# EAGLE design scheme (EAGLE 9.1.0)
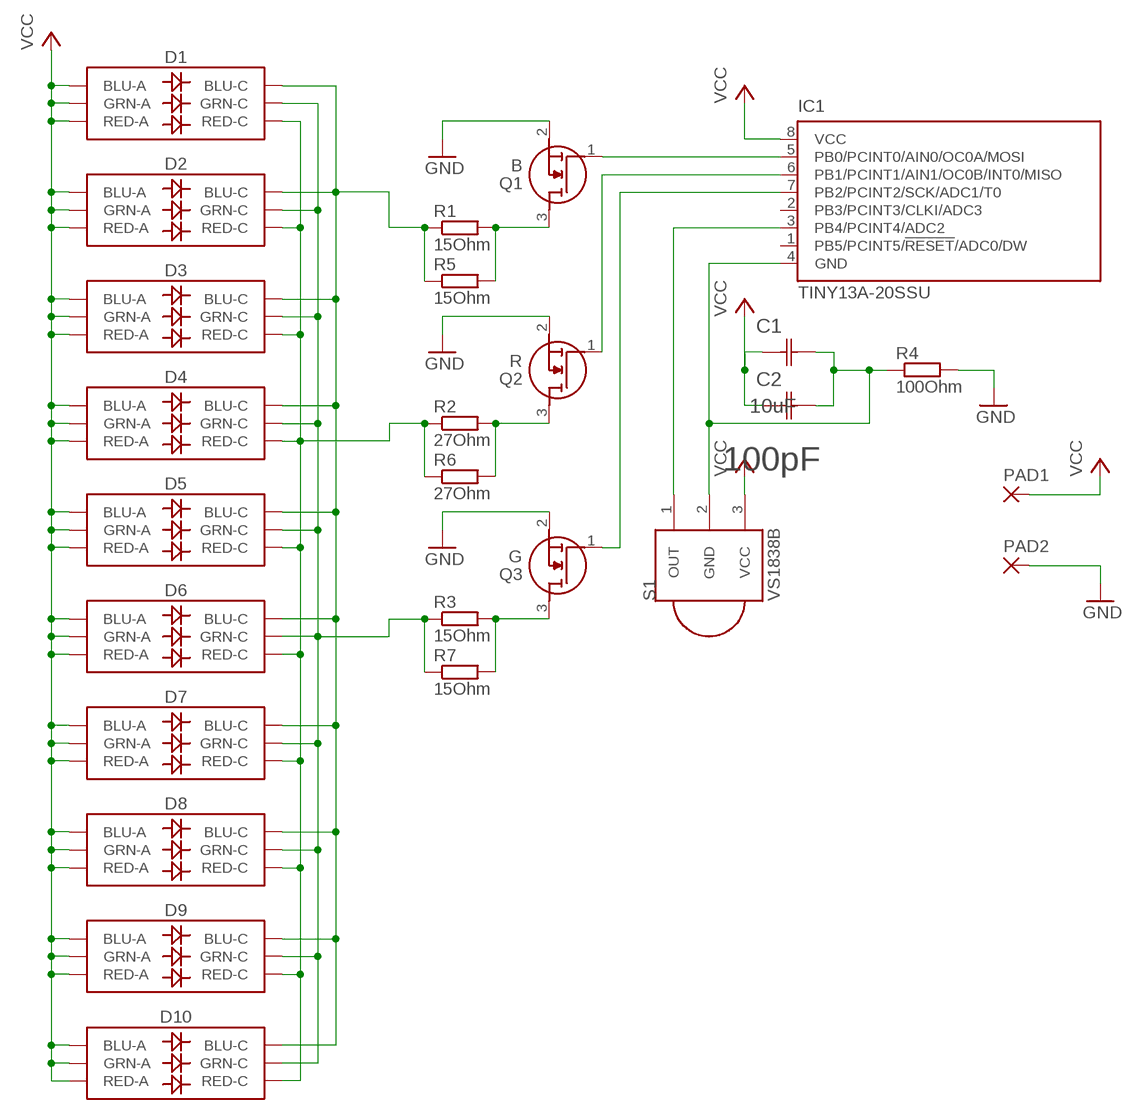
[diagram p0: schematic, sheet 1]

## Parts
C1  10uF  12061A101JAT2A  [CAPC3216X94N]
C2  100pF  08051A100JAT2A  [CAPC2013X94N]
D1  LED-RGBNO_IC  [LED-TRICOLOR-5050]
D2  LED-RGBNO_IC  [LED-TRICOLOR-5050]
D3  LED-RGBNO_IC  [LED-TRICOLOR-5050]
D4  LED-RGBNO_IC  [LED-TRICOLOR-5050]
D5  LED-RGBNO_IC  [LED-TRICOLOR-5050]
D6  LED-RGBNO_IC  [LED-TRICOLOR-5050]
D7  LED-RGBNO_IC  [LED-TRICOLOR-5050]
D8  LED-RGBNO_IC  [LED-TRICOLOR-5050]
D9  LED-RGBNO_IC  [LED-TRICOLOR-5050]
D10  LED-RGBNO_IC  [LED-TRICOLOR-5050]
IC1  TINY13A-20SSU  TINY13-20SSU  [8S1]
PAD1  SMD2  [SMD1,27-2,54]
PAD2  SMD2  [SMD1,27-2,54]
Q1  B  AO3400  [SOT95P280X125-3N]
Q2  R  AO3400  [SOT95P280X125-3N]
Q3  G  AO3400  [SOT95P280X125-3N]
R1  15Ohm  R-EU_R1206  [R1206]
R2  27Ohm  R-EU_R1206  [R1206]
R3  15Ohm  R-EU_R1206  [R1206]
R4  100Ohm  R-EU_R0805  [R0805]
R5  15Ohm  R-EU_R0805  [R0805]
R6  27Ohm  R-EU_R0805  [R0805]
R7  15Ohm  R-EU_R0805  [R0805]
S1  VS1838B  PNA460XM  [PNA460XM]

## Nets
GND: PAD2.1(P) Q1.2(S) Q2.2(S) Q3.2(S) R4.2
N$1: IC1.3(PB4/PCINT4/ADC2) S1.1(OUT)
N$2: IC1.5(PB0/PCINT0/AIN0/OC0A/MOSI) Q1.1(G)
N$3: IC1.6(PB1/PCINT1/AIN1/OC0B/INT0/MISO) Q2.1(G)
N$4: IC1.7(PB2/PCINT2/SCK/ADC1/T0) Q3.1(G)
N$6: D1.4(GRN-C) D2.4(GRN-C) D3.4(GRN-C) D4.4(GRN-C) D5.4(GRN-C) D6.4(GRN-C) D7.4(GRN-C) D8.4(GRN-C) D9.4(GRN-C) D10.4(GRN-C) R3.1 R7.1
N$7: D1.6(BLU-C) D2.6(BLU-C) D3.6(BLU-C) D4.6(BLU-C) D5.6(BLU-C) D6.6(BLU-C) D7.6(BLU-C) D8.6(BLU-C) D9.6(BLU-C) D10.6(BLU-C) R1.1 R5.1
N$8: Q1.3(D) R1.2 R5.2
N$9: Q2.3(D) R2.2 R6.2
N$10: Q3.3(D) R3.2 R7.2
N$12: C1.2(C2) C2.2(C2) IC1.4(GND) R4.1 S1.2(GND)
N$13: D1.5(RED-C) D2.5(RED-C) D3.5(RED-C) D4.5(RED-C) D5.5(RED-C) D6.5(RED-C) D7.5(RED-C) D8.5(RED-C) D9.5(RED-C) D10.5(RED-C) R2.1 R6.1
VCC: C1.1(C1) C2.1(C1) D1.1(BLU-A) D1.2(RED-A) D1.3(GRN-A) D2.1(BLU-A) D2.2(RED-A) D2.3(GRN-A) D3.1(BLU-A) D3.2(RED-A) D3.3(GRN-A) D4.1(BLU-A) D4.2(RED-A) D4.3(GRN-A) D5.1(BLU-A) D5.2(RED-A) D5.3(GRN-A) D6.1(BLU-A) D6.2(RED-A) D6.3(GRN-A) D7.1(BLU-A) D7.2(RED-A) D7.3(GRN-A) D8.1(BLU-A) D8.2(RED-A) D8.3(GRN-A) D9.1(BLU-A) D9.2(RED-A) D9.3(GRN-A) D10.1(BLU-A) D10.2(RED-A) D10.3(GRN-A) IC1.8(VCC) PAD1.1(P) S1.3(VCC)
Unconnected: IC1.1(PB5/PCINT5/!RESET!/ADC0/DW) IC1.2(PB3/PCINT3/CLKI/ADC3)

## Library data of the parts
C1 = C_1206:12061A101JAT2A; DESCRIPTION: Capacitor 1206; MPN: 12061A101JAT2A; OC_FARNELL: 499274; OC_NEWARK: 27C4497; SUPPLIER: AVX; TOLERANCE: ±5%; VALUE: 100PF; VOLTAGERATING: 100V
C2 = C_0805:08051A100JAT2A: Capacitor 0805; MPN: 08051A100JAT2A; OC_FARNELL: 499158; OC_NEWARK: 96K4767; SUPPLIER: AVX; TOLERANCE: ±5%; VALUE: 10pF; VOLTAGERATING: 100V
D1-D10 = 5050_RGB_LED:LED-RGB: LED-RGB 6 pin RGB LED (no common connector) Packages: PLCC-6 LED-TRICOLOR-5050 - No built-in IC SparkFun Products: Digital Sandbox <https://www.sparkfun.com/products/12651> LED- SMD RGB <https://www.sparkfun.com/products/10866>; PROD_ID: DIO-10298
IC1 = atmel:TINY13: 8-bit AVR Microcontroller with 1K Bytes In-System Programmable Flash Source: http://www.atmel.com/dyn/resources/prod_documents/2535S.pdf; MPN: ATTINY13-20SSU; OC_FARNELL: 1455133; OC_NEWARK: 58M3771
PAD1 PAD2 = wirepad:SMD2: SMD PAD
Q1-Q3 = AO3400:AO3400: 30V N-Channel MOSFET Source: Datasheet <http://aosmd.com/res/data_sheets/AO3400.pdf>; ARROW_PART_NUMBER: AO3400; ARROW_PRICE/STOCK: https://www.arrow.com/en/products/ao3400/alpha-and-omega-semiconductor; DESCRIPTION: 30V N-Channel MOSFET; HEIGHT: 1.25mm; MANUFACTURER_NAME: Alpha & Omega Semiconductors; MANUFACTURER_PART_NUMBER: AO3400
R1-R7 = resistor:R-EU_: RESISTOR, European symbol
S1 = adafruit:PNA460XM: IR 38KHz receiver PNA4602 and related receivers http://www.ladyada.net/library/pcb/eaglelibrary.html

## Net classes
0 default: width 0.4 mm, drill 0.2 mm, clearance 0.2 mm

## Board
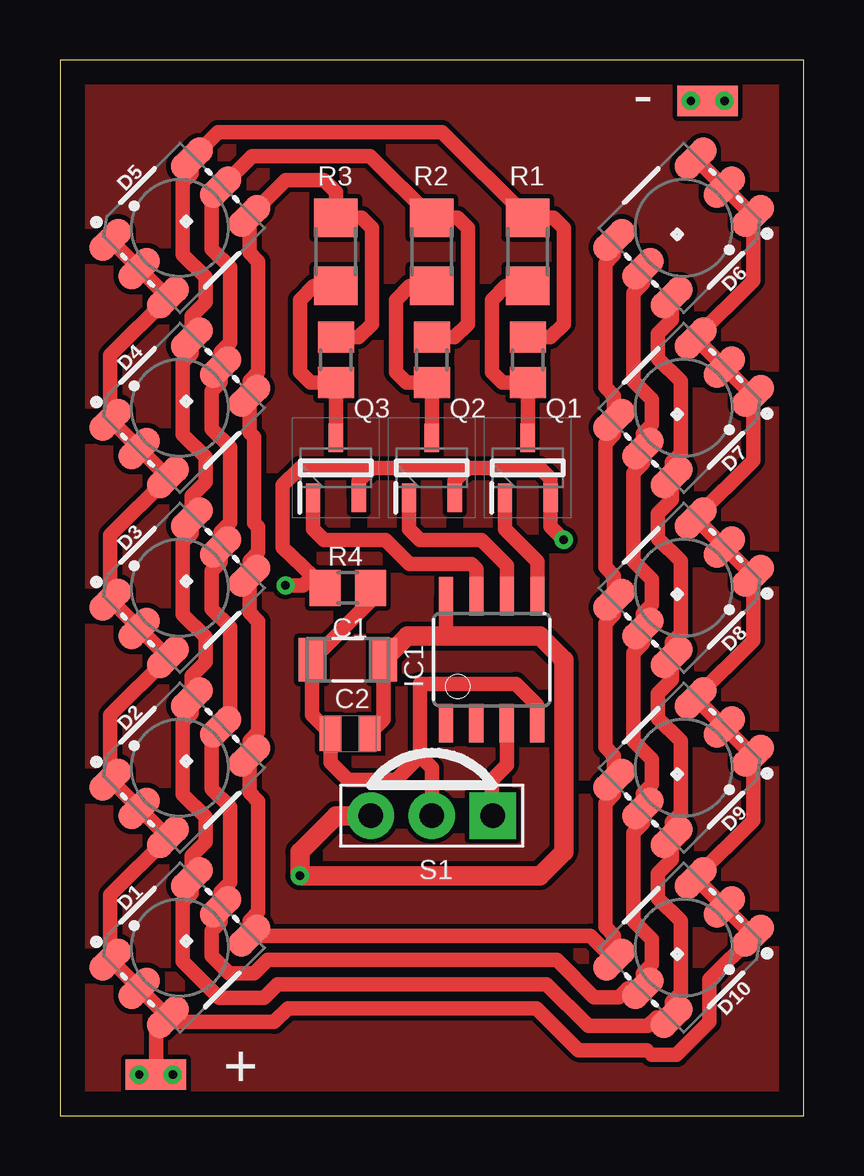
[diagram p1: board, top side]
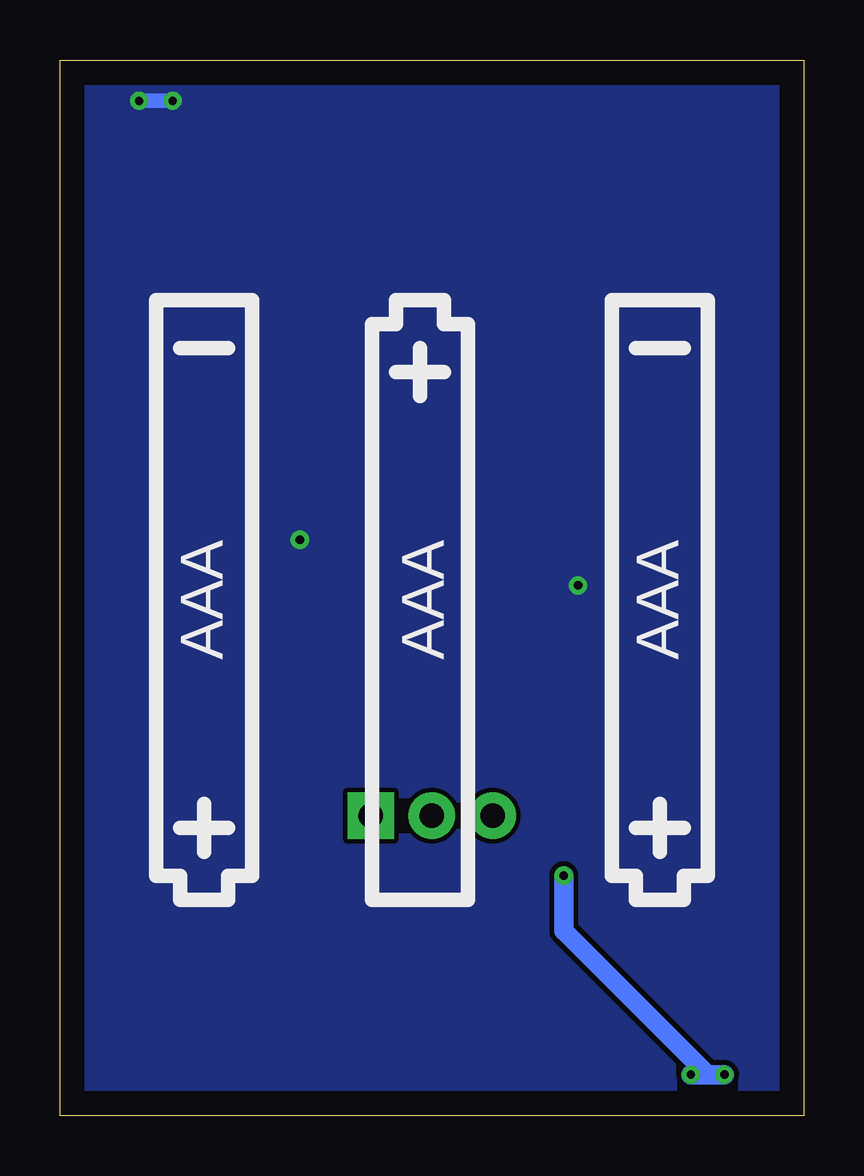
[diagram p2: board, bottom side, seen from below]

Size 31 x 44 mm. Coordinates in mm from the lower left corner, seen from the top.
Outline: 0,0 31,0 31,44 0,44 0,0
Copper layers (1*16): Top 0.035mm / dielectric 1.5mm / Bottom 0.035mm
Design rules "default": minimum track width 6mil, minimum drill 0.35mm, track to track 6mil, track to pad 6mil, pad to pad 6mil, via to via 6mil, smd to smd 6mil, copper to edge 40mil, drill to drill 6mil, minimum pad ring 10mil, minimum via ring 8mil, stop-mask expansion 4mil, vias tented up to drill 0mil, thermal gap 10mil

### Footprints (pad centres in the part's own frame; a part is rotated, then mirrored left to right if it is on the bottom)
CAPC3216X94N = smd 1.118 x 1.803: 1 -1.499,0; 2 1.499,0
CAPC2013X94N = smd 0.914 x 1.448: 1 -0.813,0; 2 0.813,0
LED-TRICOLOR-5050 = smd 2 x 1.1: 1 -2.4,1.7; 2 -2.4,0; 3 -2.4,-1.7; 4 2.4,-1.7; 5 2.4,0; 6 2.4,1.7
8S1 = smd 0.6 x 1.6: 1 -1.905,-2.654; 2 -0.645,-2.654; 3 0.625,-2.654; 4 1.895,-2.654; 5 1.905,2.654; 6 0.635,2.654; 7 -0.635,2.654; 8 -1.905,2.654
SMD1,27-2,54 = smd 1.27 x 2.54: 1 0,0
SOT95P280X125-3N = smd 1.2 x 0.6: 1 -1.25,0.95; 2 -1.25,-0.95; 3 1.25,0
R1206 = smd 1.6 x 1.803: 1 -1.422,0; 2 1.422,0
R0805 = smd 1.3 x 1.5: 1 -0.95,0; 2 0.95,0
PNA460XM = drill 1.016 pad 1.93 square: 1 -2.54,0 | drill 1.016 pad 1.93: 2 0,0; 3 2.54,0

### Placement (x,y rotation side)
C1  12,19 180 top
C2  12.1,15.92 180 top
D1  5,7 45 top
D2  5,14.5 45 top
D3  5,22 45 top
D4  5,29.5 45 top
D5  5,37 45 top
D6  26,37 225 top
D7  26,29.5 225 top
D8  26,22 225 top
D9  26,14.5 225 top
D10  26,7 225 top
IC1  18,19 0 top
PAD1  4,1.7 90 top
PAD2  27,42.3 90 top
Q1  19.5,27 90 top
Q2  15.5,27 90 top
Q3  11.5,27 90 top
R1  19.5,36 270 top
R2  15.5,36 270 top
R3  11.5,36 270 top
R4  12,22 180 top
R5  19.5,31.5 270 top
R6  15.5,31.5 270 top
R7  11.5,31.5 270 top
S1  15.5,12.5 180 top

### Tracks (layer width: path | path; a pad name or v marks a point on that pad's centre or on a via)
GND  (via drill 0.35)
  Top 0.61: Q3.2 12.45,26.45 13,27 | 13,27 17,27 | 17,27 20,27 20.45,26.55 Q1.2 20.45,24.55 v21,24 | Q2.2 16.45,26.45 17,27 | R4.2 10.52,22.5 | 10.52,22.5 9.27,23.68 9.27,26.27 10,27 13,27 | v9.4,22.1 10.13,22.1 10.52,22.5 | PAD2.1 v27.7,42.3
  Bottom 0.61: v26.3,42.3 v27.7,42.3
  pour Bottom: 0,0 0,44 31,44 31,0
N$1
  Top 0.61: IC1.3 18.62,14.62 18,14 18,12.54 S1.1
N$2
  Top 0.61: IC1.5 19.91,23.09 18.55,24.45 Q1.1
N$3
  Top 0.61: IC1.6 18.64,22.94 17.57,24 15,24 14.55,24.45 Q2.1
N$4
  Top 0.61: IC1.7 17.36,22.78 17.15,22.99 14.58,22.99 13.57,24 11,24 10.55,24.45 Q3.1
N$6
  Top 0.61: D6.4 23.1,35.88 22.73,35.5 22.73,30.36 23.1,29.99 D7.4 23.1,28.38 22.73,28 22.73,22.86 23.1,22.49 D8.4 23.1,20.88 22.73,20.5 22.73,15.36 23.1,14.99 D9.4 23.1,13.38 22.73,13 22.73,7.86 23.1,7.49 D10.4 22.11,7.5 D1.4 7.9,8.12 8.27,8.49 8.27,13.1 7.9,13.47 D2.4 7.9,15.62 8.27,15.99 8.27,20.6 7.9,20.97 D3.4 7.9,23.12 8.27,23.5 8.27,24.54 8.1,24.71 8.1,28.27 7.9,28.47 D4.4 7.9,30.62 8.27,31 8.27,35.6 7.9,35.97 D5.4 9.4,39 11,39 11.5,38.5 R3.1 12.58,37.42 13,37 13,33 12.45,32.45 R7.1
N$7
  Top 0.61: D6.6 25.5,33.18 24.92,32.6 24.92,31.56 25.88,30.61 25.88,27.6 25.5,27.23 D7.6 25.5,25.68 24.92,25.1 24.92,24.06 25.88,23.11 25.88,20.1 25.5,19.73 D8.6 25.5,18.18 24.92,17.6 24.92,16.56 25.88,15.61 25.88,12.6 25.5,12.23 D9.6 25.5,10.68 24.92,10.1 24.92,9.06 25.88,8.11 25.88,5.1 25.5,4.73 D10.6 24.88,4.1 24.5,3.73 22.04,3.73 20.29,5.48 9.08,5.48 8.52,4.91 6.64,4.91 5.12,6.43 5.12,8.9 5.5,9.27 D1.6 5.5,10.82 6.08,11.4 6.08,12.44 5.12,13.39 5.12,16.4 5.5,16.77 D2.6 5.5,18.32 6.08,18.9 6.08,19.94 5.12,20.89 5.12,23.9 5.5,24.27 D3.6 5.5,25.82 6.08,26.4 6.08,27.44 5.12,28.39 5.12,31.4 5.5,31.77 D4.6 5.5,33.32 6.08,33.9 6.08,34.94 5.12,35.89 5.12,38.9 5.5,39.27 D5.6 6.6,41 15.92,41 R1.1 20.58,37.42 21,37 21,33 20.45,32.45 R5.1
N$8
  Top 0.61: Q1.3 R5.2 18.45,30.55 18,31 18,34 18.58,34.58 R1.2
N$9
  Top 0.61: Q2.3 R6.2 14.45,30.55 14,31 14,34 14.58,34.58 R2.2
N$10
  Top 0.61: Q3.3 R7.2 10.45,30.55 10,31 10,34 10.58,34.58 R3.2
N$11
  pour Top: 0,0 0,44 31,44 31,0
N$12
  Top 0.61: R4.1 12.95,21.45 C1.2 10.5,16.71 C2.2 11.29,14.71 12,14 14,14 15,15 | 15,15 15,18 19,18 19.89,17.11 IC1.4 | S1.2 15.5,14.5 15,15
N$13
  Top 0.61: D6.5 24.3,34.67 23.91,34.28 23.91,30.6 24.67,29.84 24.67,28.8 24.3,28.43 D7.5 24.3,27.17 23.91,26.78 23.91,23.1 24.67,22.34 24.67,21.3 24.3,20.93 D8.5 24.3,19.67 23.91,19.28 23.91,15.6 24.67,14.84 24.67,13.8 24.3,13.43 D9.5 24.3,12.17 23.91,11.78 23.91,8.1 24.67,7.34 24.67,6.3 24.3,5.93 D10.5 23.67,5.3 23.3,4.93 22.26,4.93 20.71,6.49 8.66,6.49 8.1,5.92 7.06,5.92 6.33,6.66 6.33,7.7 6.7,8.07 D1.5 6.7,9.33 7.09,9.72 7.09,12.86 6.33,13.62 6.33,15.83 D2.5 7.09,16.59 7.09,20.36 6.33,21.12 6.33,22.7 6.7,23.07 D3.5 6.7,24.33 7.09,24.72 7.09,27.86 6.33,28.62 6.33,30.2 6.7,30.57 D4.5 6.7,31.83 7.09,32.22 7.09,35.36 6.33,36.12 6.33,38.33 D5.5 8,40 | R6.1 16.45,32.45 17,33 17,37 16.58,37.42 R2.1 12.92,40 8,40 | 8,40 | 8,40
VCC  (via drill 0.35)
  Top 0.61: C2.1 13.5,16.51 C1.1 | IC1.8 16.09,20.09 16.19,20 | D5.1 D5.2 | D5.2 | D5.2 D5.3 | D5.3 | D5.3 2.1,31.7 D4.1 | D4.1 | D4.1 D4.2 D4.3 | D4.3 | D4.3 2.1,24.2 D3.1 D3.2 | D3.2 | D3.2 D3.3 | D3.3 | D3.3 2.1,16.7 D2.1 D2.2 | D2.2 | D2.2 D2.3 | D2.3 | D2.3 2.1,9.2 D1.1 D1.2 | D1.2 | D10.2 D10.1 27.08,5.67 27.08,3.9 25.71,2.53 24.67,2.53 24.48,2.72 21.62,2.72 19.87,4.47 9.5,4.47 8.94,3.9 4.7,3.9 D1.3 | D10.2 | D10.2 D10.3 | D10.3 | D10.3 28.9,12.3 D9.1 D9.2 | D9.2 | D9.2 D9.3 | D9.3 | D9.3 28.9,19.8 D8.1 D8.2 | D8.2 | D8.2 D8.3 | D8.3 | D8.3 28.9,27.3 D7.1 D7.2 | D7.2 | D7.2 D7.3 | D7.3 | D7.3 28.9,34.8 D6.1 D6.2 | D6.2 | D6.2 D6.3 | D6.3 | v3.3,1.7 PAD1.1 4,3.6 D1.3 | D1.3 D1.2 | D1.2
  Top 0.813: 16.09,20.09 16.19,20 | 16.19,20 20,20 21.01,18.99 21.01,15.22 21,15.21 21,11 20,10 v10,10 10,11 11.5,12.5 S1.3 | C1.1 14.5,20 16.19,20
  Bottom 0.813: v3.3,1.7 PAD1.1 | PAD1.1 v4.7,1.7 | PAD1.1 10,7.7 v10,10

### Text on the board
bPlace: AAA | AAA | AAA
tNames: - | +